# EAGLE design Mergen Telemetri + Ateşleme (EAGLE 9.6.2)
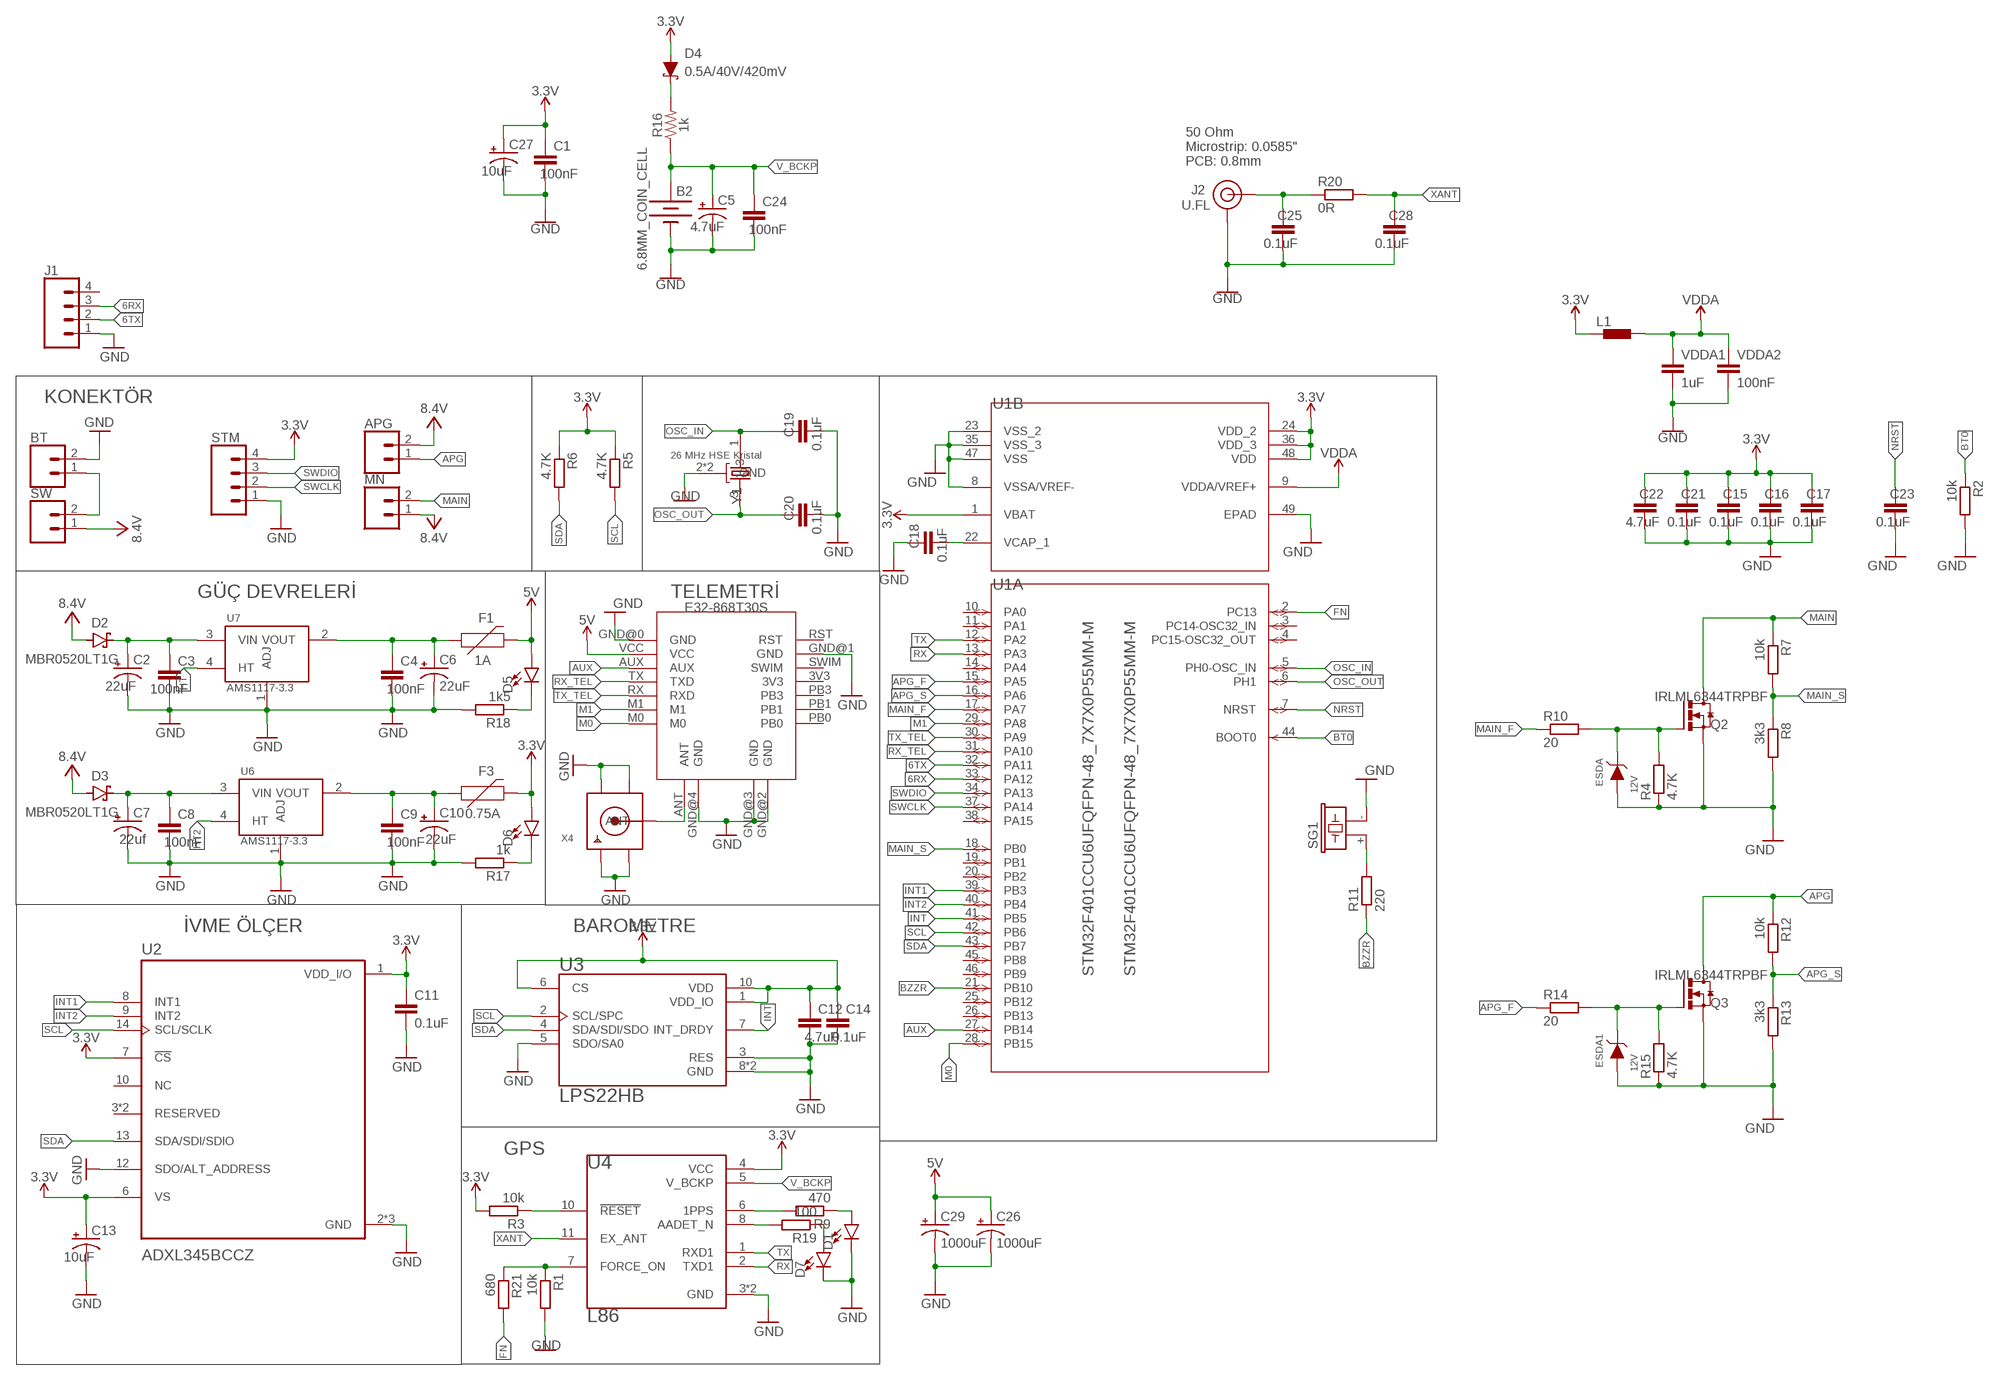
[diagram p0: schematic, sheet 1]

## Parts
APG  CONN_02POLAR  [MOLEX-1X2]
B2  6.8MM_COIN_CELL  BATTERY-6.8MM_SMD  [BATTCON-6.8MM]
BT  CONN_02POLAR  [MOLEX-1X2]
C1  100nF  C-EUC0402K  [C0402K]
C2  22uF  CPOL-USR/2012-12W  [R/2012-12W]
C3  100nF  C-EUC0402K  [C0402K]
C4  100nF  C-EUC0402K  [C0402K]
C5  4.7uF  CPOL-USR/2012-12W  [R/2012-12W]
C6  22uF  CPOL-USR/2012-12W  [R/2012-12W]
C7  22uf  CPOL-USR/2012-12W  [R/2012-12W]
C8  100nF  C-EUC0402K  [C0402K]
C9  100nF  C-EUC0402K  [C0402K]
C10  22uF  CPOL-USR/2012-12W  [R/2012-12W]
C11  0.1uF  C-EUC0402K  [C0402K]
C12  4.7uF  C-EUC0402K  [C0402K]
C13  10uF  CPOL-USR/2012-12W  [R/2012-12W]
C14  0.1uF  C-EUC0402K  [C0402K]
C15  0.1uF  C-EUC0402K  [C0402K]
C16  0.1uF  C-EUC0402K  [C0402K]
C17  0.1uF  C-EUC0402K  [C0402K]
C18  0.1uF  C-EUC0402K  [C0402K]
C19  0.1uF  C-EUC0402K  [C0402K]
C20  0.1uF  C-EUC0402K  [C0402K]
C21  0.1uF  C-EUC0402K  [C0402K]
C22  4.7uF  C-EUC0402K  [C0402K]
C23  0.1uF  C-EUC0402K  [C0402K]
C24  100nF  C-EUC0402K  [C0402K]
C25  0.1uF  C-EUC0402K  [C0402K]
C26  1000uF  CPOL-US150CLZ-1010  [150CLZ-1010]
C27  10uF  CPOL-USR/2012-12W  [R/2012-12W]
C28  0.1uF  C-EUC0402K  [C0402K]
C29  1000uF  CPOL-US150CLZ-1010  [150CLZ-1010]
D1  LED0603  [LED-0603]
D2  MBR0520LT1G  SCHOTTKY_MBR0520LT1GDO-219  [SODFL3718X115]
D3  MBR0520LT1G  SCHOTTKY_MBR0520LT1GDO-219  [SODFL3718X115]
D4  0.5A/40V/420mV  DIODE-SCHOTTKY-PMEG4005EJ  [SOD-323]
D5  LED0603  [LED-0603]
D6  LED0603  [LED-0603]
D7  LED0603  [LED-0603]
ESDA  12V  WE-TVSP_DO-214AC_400W_UNI_824500102  [WE-TVSP_DO-214AC_UNIDIRECTIONAL]
ESDA1  12V  WE-TVSP_DO-214AC_400W_UNI_824500102  [WE-TVSP_DO-214AC_UNIDIRECTIONAL]
F1  1A  PPTC_HALF-AMP  [1206]
F3  0.75A  PPTC_HALF-AMP  [1206]
J1  CONN_04JST-PTH-VERT  [JST-4-PTH-VERT]
J2  U.FL  U.FL2PIN  [U.FL]
L1  BLM15HB221SN1  [0402]
MN  CONN_02POLAR  [MOLEX-1X2]
Q2  IRLML6344TRPBF  [SOT23]
Q3  IRLML6344TRPBF  [SOT23]
R1  10k  R-EU_R0402  [R0402]
R2  10k  R-EU_R0402  [R0402]
R3  10k  R-EU_R0402  [R0402]
R4  4.7K  R-EU_R0402  [R0402]
R5  4.7K  R-EU_R0402  [R0402]
R6  4.7K  R-EU_R0402  [R0402]
R7  10k  R-EU_R0402  [R0402]
R8  3k3  R-EU_R0402  [R0402]
R9  470  R-EU_R0402  [R0402]
R10  20  R-EU_R0402  [R0402]
R11  220  R-EU_R0402  [R0402]
R12  10k  R-EU_R0402  [R0402]
R13  3k3  R-EU_R0402  [R0402]
R14  20  R-EU_R0402  [R0402]
R15  4.7K  R-EU_R0402  [R0402]
R16  1k  1KOHM-0603-1/10W-1%  [0603]
R17  1k  R-EU_R0402  [R0402]
R18  1k5  R-EU_R0402  [R0402]
R19  100  R-EU_R0402  [R0402]
R20  0R  R-EU_R0402  [R0402]
R21  680  R-EU_R0402  [R0402]
SG1  F/CM12P  [F/CM12P]
STM  CONN_04  [1X04]
SW  CONN_02POLAR  [MOLEX-1X2]
U1  STM32F401CCU6UFQFPN-48_7X7X0P55MM-M  [UFQFPN-48_7X7X0P55MM-M]
U2  ADXL345BCCZ  [PQFN80P300X500X100-14N]
U3  LPS22HB  [LGA10R50P2X3_200X200X80]
U4  L86  [XCVR_L86]
U5  E32-868T30S  [E32-868T30S]
U6  AMS1117-3.3  [SOT229P700X180-4N]
U7  AMS1117-3.3  [SOT229P700X180-4N]
VDDA1  1uF  0.1UF-0603-25V-(+80/-20%)  [0603]
VDDA2  100nF  0.1UF-0603-25V-(+80/-20%)  [0603]
X4  SMACONNECTOR  [SMA90_DIP]
Y1  ABM3B-26.000MHZ-10-1-U-T  [OSCCC500X320X110-4N]

## Nets
3.3V: C1.1 C11.1 C12.1 C13.+ C14.1 C15.1 C16.1 C17.1 C21.1 C22.1 C27.+ D4.A D6.A F3.2 L1.1 R3.2 R5.1 R6.1 STM.4 U1.1(B:VBAT) U1.24(B:VDD_2) U1.36(B:VDD_3) U1.48(B:VDD) U2.1(VDD_I/O) U2.6(VS) U2.7(!CS) U3.1(VDD_IO) U3.6(CS) U3.10(VDD) U4.4(VCC)
5V: C26.+ C29.+ D5.A F1.2 U5.VCC
6RX: J1.3 U1.33(A:PA12)
6TX: J1.2 U1.32(A:PA11)
APG: APG.1 Q3.3(D) R12.1
APG_F: R14.1 U1.15(A:PA5)
APG_S: R12.2 R13.1 U1.16(A:PA6)
AUX: U1.27(A:PB14) U5.AUX
BT0: R2.1 U1.44(A:BOOT0)
BZZR: R11.1 U1.21(A:PB10)
FN: R21.2 U1.2(A:PC13)
GND: B2.- BT.2 C1.2 C2.- C3.2 C4.2 C5.- C6.- C7.- C8.2 C9.2 C10.- C11.2 C12.2 C13.- C14.2 C15.2 C16.2 C17.2 C18.1 C19.2 C20.2 C21.2 C22.2 C23.2 C24.2 C25.2 C26.- C27.- C28.2 C29.- D1.C D7.C ESDA1.2(A) ESDA.2(A) J1.1 J2.1(GND) J2.2(GND) Q2.2(S) Q3.2(S) R1.2 R2.2 R4.1 R8.2 R13.2 R15.1 R17.2 R18.2 SG1.- STM.1 U1.8(B:VSSA/VREF-) U1.23(B:VSS_2) U1.35(B:VSS_3) U1.47(B:VSS) U1.49(B:EPAD) U2.2(GND) U2.4(GND) U2.5(GND) U2.12(SDO/ALT_ADDRESS) U3.3(RES) U3.5(SDO/SA0) U3.8(GND) U3.9(GND) U4.3(GND) U4.12(GND) U5.GND@0(GND) U5.GND@1(GND) U5.GND@2(GND) U5.GND@3(GND) U5.GND@4(GND) U6.1(ADJ) U7.1(ADJ) VDDA1.2 VDDA2.2 X4.GND1 X4.GND2 X4.GND3 X4.GND4 Y1.2(GND) Y1.4(GND)
HT: U7.4(HT)
HT2: U6.4(HT)
INT: U1.41(A:PB5) U3.7(INT_DRDY)
INT1: U1.39(A:PB3) U2.8(INT1)
INT2: U1.40(A:PB4) U2.9(INT2)
M0: U1.28(A:PB15) U5.M0
M1: U1.29(A:PA8) U5.M1
MAIN: MN.2 Q2.3(D) R7.1
MAIN_F: R10.1 U1.17(A:PA7)
MAIN_S: R7.2 R8.1 U1.18(A:PB0)
N$1: C2.+ C3.1 D2.1(C) U7.3(VIN)
N$2: C7.+ C8.1 D3.1(C) U6.3(VIN)
N$3: R3.1 U4.10(!RESET)
N$4: C4.1 C6.+ F1.1 U7.2(VOUT)
N$5: C9.1 C10.+ F3.1 U6.2(VOUT)
N$6: ESDA1.1(C) Q3.1(G) R14.2 R15.2
N$7: U5.ANT X4.ANTENNA(ANT)
N$8: R11.2 SG1.+
N$9: BT.1 SW.2
N$10: R9.2 U4.6(1PPS)
N$11: D1.A R9.1
N$12: D4.C R16.2
N$13: ESDA.1(C) Q2.1(G) R4.2 R10.2
N$14: D5.C R18.1
N$15: D6.C R17.1
N$16: R19.2 U4.8(AADET_N)
N$17: D7.A R19.1
N$18: C18.2 U1.22(B:VCAP_1)
N$19: C25.1 J2.FEED(SIGNAL) R20.1
N$20: R1.1 R21.1 U4.7(FORCE_ON)
NRST: C23.1 U1.7(A:NRST)
OSC_IN: C19.1 U1.5(A:PH0-OSC_IN) Y1.1
OSC_OUT: C20.1 U1.6(A:PH1) Y1.3
RX: U1.13(A:PA3) U4.2(TXD1)
RX_TEL: U1.31(A:PA10) U5.TX(TXD)
SCL: R5.2 U1.42(A:PB6) U2.14(SCL/SCLK) U3.2(SCL/SPC)
SDA: R6.2 U1.43(A:PB7) U2.13(SDA/SDI/SDIO) U3.4(SDA/SDI/SDO)
SWCLK: STM.2 U1.37(A:PA14)
SWDIO: STM.3 U1.34(A:PA13)
TX: U1.12(A:PA2) U4.1(RXD1)
TX_TEL: U1.30(A:PA9) U5.RX(RXD)
V_BCKP: B2.+ C5.+ C24.1 R16.1 U4.5(V_BCKP)
VCC: APG.2 D2.2(A) D3.2(A) MN.1 SW.1 ; supply symbol labelled 8.4V
VDDA: L1.2 U1.9(B:VDDA/VREF+) VDDA1.1 VDDA2.1
XANT: C28.1 R20.2 U4.11(EX_ANT)
Unconnected: J1.4 U1.3(A:PC14-OSC32_IN) U1.4(A:PC15-OSC32_OUT) U1.10(A:PA0) U1.11(A:PA1) U1.14(A:PA4) U1.19(A:PB1) U1.20(A:PB2) U1.25(A:PB12) U1.26(A:PB13) U1.38(A:PA15) U1.45(A:PB8) U1.46(A:PB9) U2.3(RESERVED) U2.10(NC) U2.11(RESERVED) U5.3V3 U5.PB0 U5.PB1 U5.PB3 U5.RST U5.SWIM

## Notes on the sheet
- 50 Ohm 
  Microstrip: 0.0585"
  PCB: 0.8mm
- KONEKTÖR
- 26 MHz HSE Kristal
- GÜÇ DEVRELERİ | TELEMETRİ
- İVME ÖLÇER | BAROMETRE
- GPS

## Library data of the parts
APG BT MN SW = SparkFun-Connectors:CONN_02: Multi connection point. Often used as Generic Header-pin footprint for 0.1 inch spaced/style header connections On any of the 0.1 inch spaced packages, you can populate with these: Break Away Headers - Straight <https://www.sparkfun.com/products/116> (PRT-00116) Break Away Male Headers - Right Angle <https://www.sparkfun.com/products/553> (PRT-00553) Female Headers <https://www.sparkfun.com/products/115> (PRT-00115) Break Away Headers - Machine Pin <https://www.sparkfun.com/products/117> (PRT-00117) Break Away Female Headers - Swiss Machine Pin <https://www.sparkfun.com/products/743> (PRT-00743) For SCREWTERMINALS and SPRING TERMINALS visit here: Screw Terimnals on SparkFun.com <https://www.sparkfun.com/search/results?term=Screw+Terminals> (5mm/3.5mm/2.54mm spacing) This device is also useful as a general connection point to wire up your design to another part of your project. Our various solder wires solder well into these plated through hole pads. Hook-Up Wire - Assortment (Stranded, 22 AWG) <https://www.sparkfun.com/products/11375> (PRT-11375) Hook-Up Wire - Assortment (Solid Core, 22 AWG) <https://www.sparkfun.com/products/11367> (PRT-11367) View the entire wire category on our website here <https://www.sparkfun.com/categories/141> Special notes: Molex polarized connector foot print use with: PRT-08233 with associated crimp pins and housings. 2.54_SCREWTERM for use with PRT-10571. 3.5mm Screw Terminal footprints for PRT-08084 5mm Screw Terminal footprints for use with PRT-08432; SF_ID: PRT-09918
B2 = SparkFun-Batteries:BATTERY: Battery - Single Cell A variety of battery chemistries, sizes, and footprints. Device List: 20MM_PTH - Coin Cell Battery Holder - 20mm (PTH) <https://www.sparkfun.com/products/783> 6.8MM_PTH - Coin Cell Battery Holder - 6.8MM(SMD) <https://www.digikey.com/product-detail/en/seiko-instruments/MS621FE-FL11E/728-1057-ND/1889208?WT.srch=1&gclid=CNOQ5a6LzdQCFZS2wAodXCkE0g> 12MM_SMD - Coin Cell Battery Holder - 12mm (SMD) <https://www.sparkfun.com/products/10592> 12MM_PTH - Coin Cell Battery Holder - 12mm (PTH) <https://www.sparkfun.com/products/7948> 20MM_SMD - 20mm Coin Cell Battery Holder (SMD) (2 legs) Used on the Big Time Watch Kit <https://www.sparkfun.com/products/11734> 20MM_SMD_4LEGS - Coin Cell Battery Holder - 20mm (SMD) <https://www.sparkfun.com/products/11892> 20MM_SMD_4LEGS_OVERPASTE - Coin Cell Battery Holder - 20mm (SMD) <https://www.sparkfun.com/products/11892> (Over-paste on the legs) 24.5MM_PTH - Coin Cell Battery Holder - 24.5mm (PTH) <https://www.sparkfun.com/products/8863> 9V - 9V Battery Holder - PC Mount Used on the SparkFun SparkPunk Sound Kit <https://www.sparkfun.com/products/11177> and SparkFun SparkPunk Sequencer Kit <https://www.sparkfun.com/products/12707> 18650 - Battery Holder - 18650 (PTH) <https://www.sparkfun.com/products/13113> AA - Battery Holder - 1xAA (PTH) <https://www.sparkfun.com/products/7949> AAA - Battery Holder - 1xAAA (PTH) <https://www.sparkfun.com/products/12718> AA_KIT - Battery Holder - 1xAA (PTH) <https://www.sparkfun.com/products/7949> Special kit package - pads only have exposed copper on one side of the board. AAA_KIT - Battery Holder - 1xAAA (PTH) <https://www.sparkfun.com/products/12718> Special kit package - pads only have exposed copper on one side of the board.; PROD_ID: BATT-13734
C1 C3 C4 C8 C9 C11 C12 C14-C25 C28 = rcl:C-EU: CAPACITOR, European symbol; SPICEPREFIX: C
C2 C5-C7 C10 C13 C27 = rcl:CPOL-US: POLARIZED CAPACITOR, American symbol; SPICEPREFIX: C
C26 C29 = adafruit:CPOL-US: POLARIZED CAPACITOR, American symbol
D1 D5-D7 = SparkFun-LED:LED: LED (Generic) Standard schematic elements and footprints for 5mm, 3mm, 1206, and 0603 sized LEDs. Generic LEDs with no color specified.
D2 D3 = Diode:SCHOTTKY_: Schottky Diode - Popular parts; CATEGORY: Diode; DESCRIPTION: DIODE SCHOTTKY 20V 500MA SOD123; MANUFACTURER: ON Semiconductor; MPN: MBR0520LT1G; SUB-CATEGORY: Schottky
D4 = SparkFun-DiscreteSemi:DIODE-SCHOTTKY: Schottky diode A Schottky diode is a semiconductor diode which has a low forward voltage drop and a very fast switching action.; PROD_ID: DIO-10955
ESDA ESDA1 = Wurth_EMC Components_WE-TVSP:WE-TVSP_DO-214AC_400W_UNI: WE-TVSP Power TVS Diode Characteristics Low Profile Package Glass passivated Juction Excellent clamping capability Fast response time MSL Level 1, per J-STD-020 Classification of the plastic case: UL 94 V-0 Safety certification UL 497B, E478010 Identical design: - DO-214AC = SMAJ - DO-214AA = SMBJ - DO-214AB = SMCJ/SMDJ Applications Ideal to protect the I/O Interfaces, Bus Voltage and other circuits of sensetive electronic equipment against voltage transiensts <https://www.we-online.com/catalog/media/o55793v209%20WE-TVSP_600W-3000W_D0214AA_4C.jpg> Details see: https://www.we-online.com/catalog/en/WE-TVSP/ Updated by Ella Wu 2020-07-20 2020 (C) Würth Elektronik; DATASHEET-URL: https://www.we-online.com/catalog/datasheet/824500102.pdf; IPEAK: 2.5A; MOUNT: SMT; PART-NUMBER: 824500102; PDISS: 400W; VALUE: 100V; VBR: 117V; VCLAMP: 162V
F1 F3 = SparkFun-Fuses:PPTC: Resettable Fuse PPTC Resettable Fuse. Really a sort of resistor with a polymeric positive temperature coefficient whose resistance increases dramatically with an increase in temperature. When heated by the power passing through the resistance rises causing the current to be limited, protecting the circuit. This is achieved by the transition of the polymer from a crystalline to an amorphous state where the conductive carbon separates breaking the conductive pathways found in the cool crystalline structure. When a PPTC cools back down it resumes conducting letting the circuit turn back on. SparkFun Products: SparkFun RedBoard - Programmed with Arduino <https://www.sparkfun.com/products/12757> Pro Micro - 5V/16MHz <https://www.sparkfun.com/products/12640> Arduino Pro 328 - 5V/16MHz <https://www.sparkfun.com/products/10915> MP3 Trigger <https://www.sparkfun.com/products/13720>; PROD_ID: RES-08585; VALUE: 6V/0.5A
J1 = SparkFun-Connectors:CONN_04: Multi connection point. Often used as Generic Header-pin footprint for 0.1 inch spaced/style header connections On any of the 0.1 inch spaced packages, you can populate with these: Break Away Headers - Straight <https://www.sparkfun.com/products/116> (PRT-00116) Break Away Male Headers - Right Angle <https://www.sparkfun.com/products/553> (PRT-00553) Female Headers <https://www.sparkfun.com/products/115> (PRT-00115) Break Away Headers - Machine Pin <https://www.sparkfun.com/products/117> (PRT-00117) Break Away Female Headers - Swiss Machine Pin <https://www.sparkfun.com/products/743> (PRT-00743) For SCREWTERMINALS and SPRING TERMINALS visit here: Screw Terimnals on SparkFun.com <https://www.sparkfun.com/search/results?term=Screw+Terminals> (5mm/3.5mm/2.54mm spacing) This device is also useful as a general connection point to wire up your design to another part of your project. Our various solder wires solder well into these plated through hole pads. Hook-Up Wire - Assortment (Stranded, 22 AWG) <https://www.sparkfun.com/products/11375> (PRT-11375) Hook-Up Wire - Assortment (Solid Core, 22 AWG) <https://www.sparkfun.com/products/11367> (PRT-11367) View the entire wire category on our website here <https://www.sparkfun.com/categories/141> Special notes: Molex polarized connector foot print use with SKU : PRT-08231 with associated crimp pins and housings. 1MM SMD Version SKU: PRT-10208; PROD_ID: CONN-13251
J2 = SparkFun-Connectors:U.FL2PIN: SMD Antenna Connector - U.FL 2mm height, 3.0mm x 3.0mm receptacle size. SparkFun Products: SparkFun WiFi Shield - ESP8266 <https://www.sparkfun.com/products/13287> SparkFun ESP8266 Thing <https://www.sparkfun.com/products/13231> SparkFun MiniGen - Pro Mini Signal Generator Shield <https://www.sparkfun.com/products/11420>; PROD_ID: CONN-09193; SF_ID: WRL-09144
L1 = inductors:BLM15H: EMIFIL (R) Chip Ferrite Bead for GHz Noise Source: http://www.murata.com/ Ferrite Bead BLM15H.pdf
Q2 Q3 = IRLML6344TRPBF (1):IRLML6344TRPBF: Transistor NMOS 30V 6.3A, 29mOhm@4.5V; AVAILABILITY: Unavailable; DESCRIPTION: RoHS Compliant | Low RDS(on) | Industry-Standard Pinout | Compatible with Existing Surface Mount Techniques | Qualified MSL1 | SOT-23 Footprint; MF: Infineon; MP: IRLML6344TRPBF; PACKAGE: SOT-23-3 International Rectifier; PRICE: None
R1-R15 R17-R21 = rcl:R-EU_: RESISTOR, European symbol; SPICEPREFIX: R
R16 = SparkFun-Resistors:1KOHM: 1kΩ resistor A resistor is a passive two-terminal electrical component that implements electrical resistance as a circuit element. Resistors act to reduce current flow, and, at the same time, act to lower voltage levels within circuits. - Wikipedia; PROD_ID: RES-07856
SG1 = buzzer:F/CM12P: BUZZER Source: Buerklin; OC_FARNELL: unknown; OC_NEWARK: unknown
STM = SparkFun-Connectors:CONN_04: Multi connection point. Often used as Generic Header-pin footprint for 0.1 inch spaced/style header connections On any of the 0.1 inch spaced packages, you can populate with these: Break Away Headers - Straight <https://www.sparkfun.com/products/116> (PRT-00116) Break Away Male Headers - Right Angle <https://www.sparkfun.com/products/553> (PRT-00553) Female Headers <https://www.sparkfun.com/products/115> (PRT-00115) Break Away Headers - Machine Pin <https://www.sparkfun.com/products/117> (PRT-00117) Break Away Female Headers - Swiss Machine Pin <https://www.sparkfun.com/products/743> (PRT-00743) For SCREWTERMINALS and SPRING TERMINALS visit here: Screw Terimnals on SparkFun.com <https://www.sparkfun.com/search/results?term=Screw+Terminals> (5mm/3.5mm/2.54mm spacing) This device is also useful as a general connection point to wire up your design to another part of your project. Our various solder wires solder well into these plated through hole pads. Hook-Up Wire - Assortment (Stranded, 22 AWG) <https://www.sparkfun.com/products/11375> (PRT-11375) Hook-Up Wire - Assortment (Solid Core, 22 AWG) <https://www.sparkfun.com/products/11367> (PRT-11367) View the entire wire category on our website here <https://www.sparkfun.com/categories/141> Special notes: Molex polarized connector foot print use with SKU : PRT-08231 with associated crimp pins and housings. 1MM SMD Version SKU: PRT-10208; PROD_ID: CONN-09696
U1 = STM32F401CCU6:STM32F401CCU6; BUILT_BY: EMA_UL_Team; COPYRIGHT: Copyright (C) 2018 Accelerated Designs. All rights reserved; MANUFACTURER_PART_NUMBER: STM32F401CCU6; SOURCELIBRARY: Updates_to_database_2020-10-19; VENDOR: STMicroelectronics
U2 = ADXL345BCCZ:ADXL345BCCZ: Check prices <https://pricing.snapeda.com/parts/ADXL345BCCZ/Analog%20Devices/view-part?ref=eda>; AVAILABILITY: Warning; DESCRIPTION: Accelerometer X, Y, Z Axis ±2g, 4g, 8g, 16g 0.05Hz ~ 1.6kHz 14-LGA (3x5); MF: Analog Devices; MP: ADXL345BCCZ; PACKAGE: LGA -14 Analog Devices; PRICE: None; PURCHASE-URL: https://pricing.snapeda.com/search/part/ADXL345BCCZ/?ref=eda
U3 = LPS22HB:LPS22HB: MEMS nano pressure sensor: 260-1260 hPa absolute digital output barometer; AVAILABILITY: Unavailable; DESCRIPTION: Pressure Sensor 3.77PSI ~ 18.27PSI (26kPa ~ 126kPa) Absolute 24 b 10-WFLGA Exposed Pad; MF: STMicroelectronics; MP: LPS22HB; PACKAGE: WFLGA-10 STMicroelectronics; PRICE: None
U4 = L86:L86: L86 is an ultra-compact GNSS POT (Patch on Top) module with an embedded 18.4mm × 18.4mm × 4.0mm patch antenna and utilizes the MediaTek new generation GNSS chipset MT3333 that achieves the perfect performance; AVAILABILITY: Unavailable; DESCRIPTION: L86 is an ultra-compact GNSS POT (Patch on Top) module with an embedded 18.4mm × 18.4mm × 4.0mm patch antenna and utilizes the MediaTek new generation GNSS chipset MT3333 that achieves the perfect performance; MF: Quectel; MP: L86; PACKAGE: PowerSFN-8 Quectel; PRICE: None
U5 = E32-868T30S:E32-868T30S: E BYTE E32-868T30S
U6 U7 = AMS1117-3.3:AMS1117-3.3: Sot223/Pkg 1-Amp 3.3-Volt Low Drop Out Voltage Regulatator; AVAILABILITY: Unavailable; DESCRIPTION: Sot223/Pkg 1-Amp 3.3-Volt Low Drop Out Voltage Regulatator; MF: Advanced Monolithic Systems; MP: AMS1117-3.3; PACKAGE: SOT-89 ams; PRICE: None
VDDA1 VDDA2 = SparkFun-Capacitors:0.1UF: 0.1µF ceramic capacitors A capacitor is a passive two-terminal electrical component used to store electrical energy temporarily in an electric field.; PROD_ID: CAP-00810; VALUE: 0.1uF
X4 = adafruit:SMACONNECTOR: SMA Connector 90° DIP SMA Connector, 50 Ohm (4UConnector: 07259)
Y1 = ABM3B-26.000MHZ-10-1-U-T:ABM3B-26.000MHZ-10-1-U-T: Ceramic SMD Crystal Check prices <https://pricing.snapeda.com/parts/ABM3B-26.000MHZ-10-1-U-T/Abracon/view-part?ref=eda>; AVAILABILITY: Good; DESCRIPTION: 26MHz ±10ppm Crystal 10pF 50 Ohms 4-SMD, No Lead; MF: Abracon; MP: ABM3B-26.000MHZ-10-1-U-T; PACKAGE: SMD-4 Abracon LLC; PRICE: None; PURCHASE-URL: https://pricing.snapeda.com/search/part/ABM3B-26.000MHZ-10-1-U-T/?ref=eda

## Board
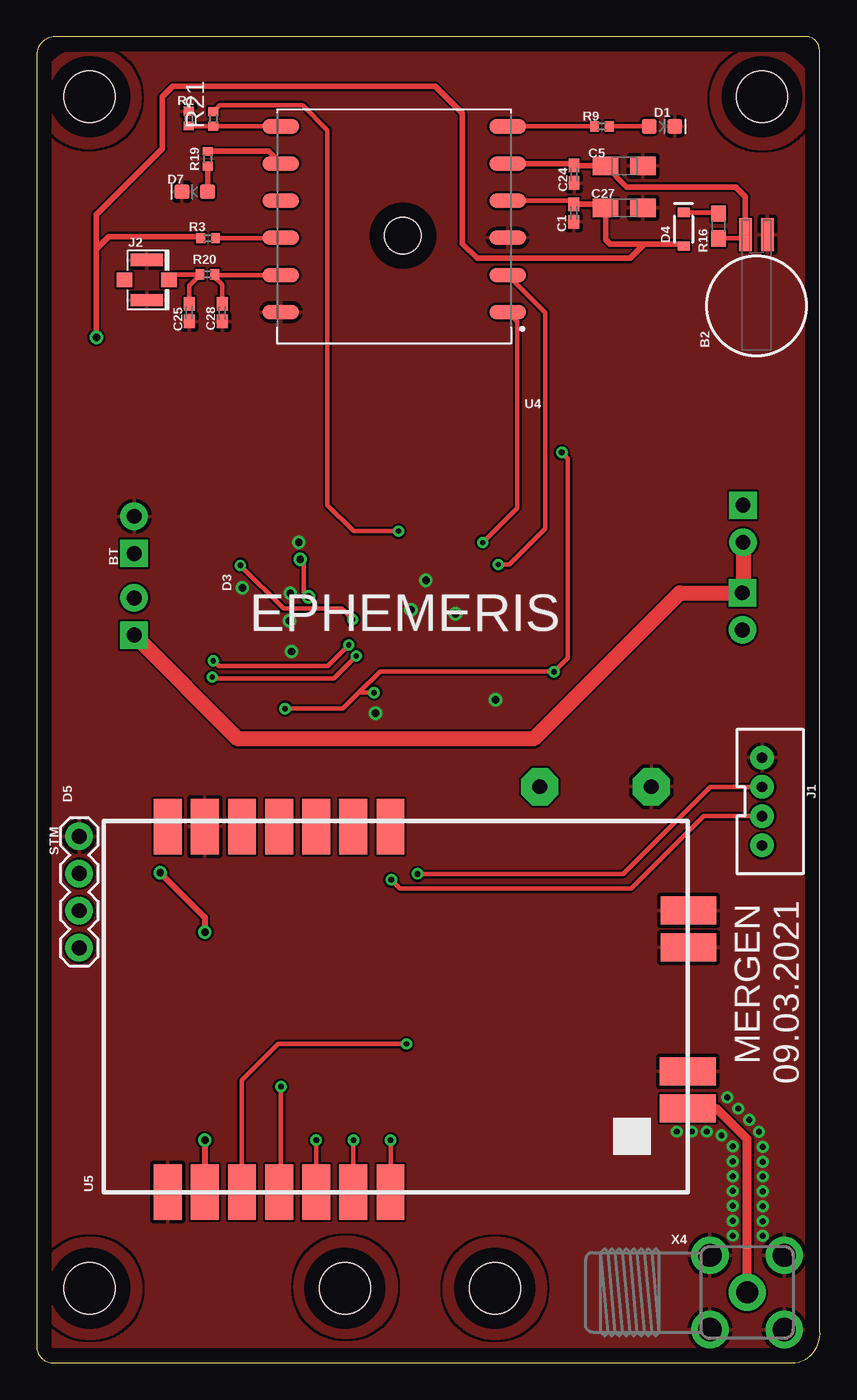
[diagram p1: board, top side]
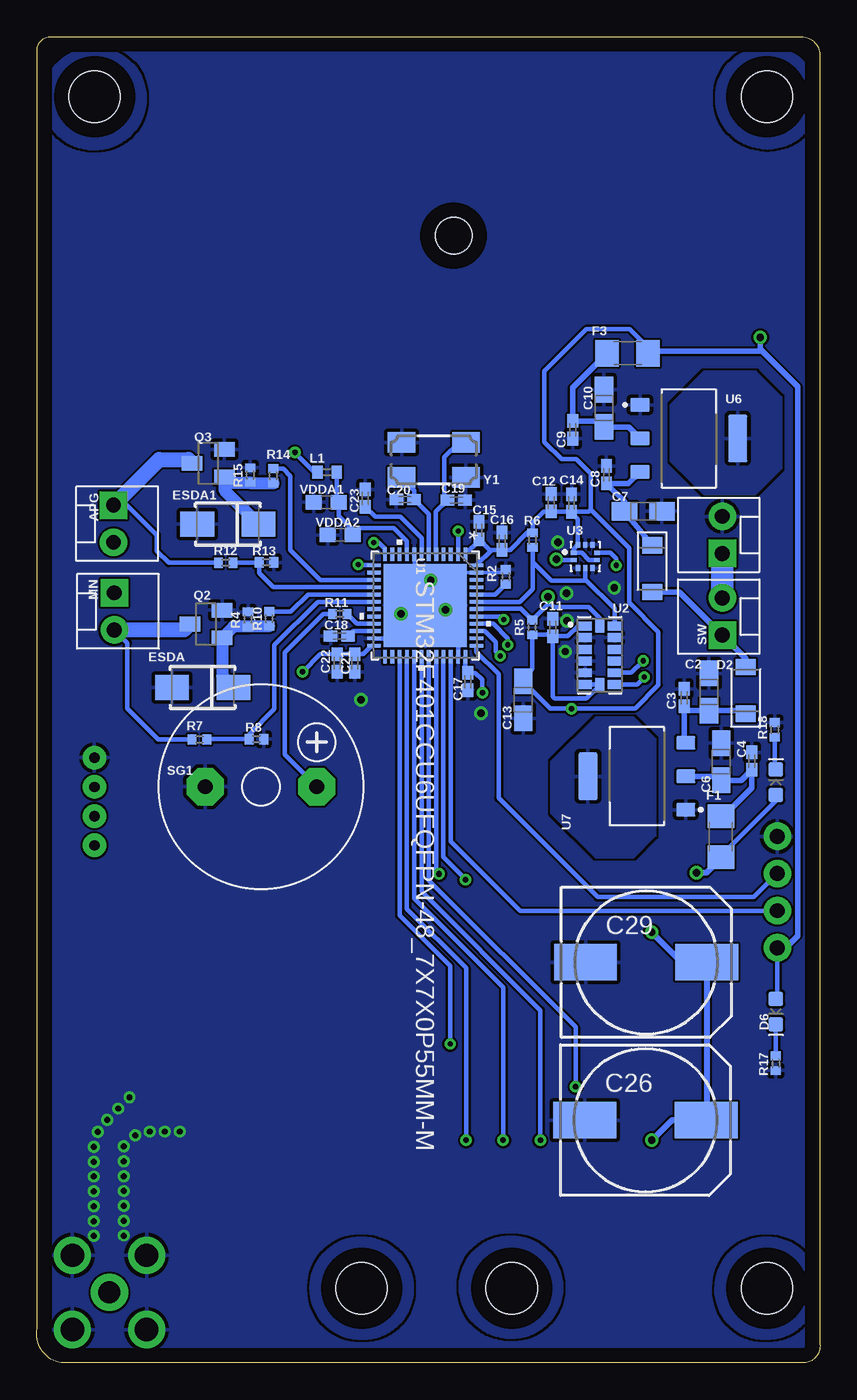
[diagram p2: board, bottom side, seen from below]

Size 53.57 x 90.73 mm. Coordinates in mm from the lower left corner, seen from the top.
Outline: 0,89.49 0,1.27 arc90 1.09,0 51.89,0 arc90 53.54,2.36 53.54,89.79 arc90 52.6,90.73 1.39,90.73 arc90 0,89.49
Copper layers (1*16): Top 0.035mm / dielectric 1.5mm / Bottom 0.035mm
Design rules "default": minimum track width 6mil, minimum drill 0.35mm, track to track 6mil, track to pad 6mil, pad to pad 6mil, via to via 6mil, smd to smd 6mil, copper to edge 40mil, drill to drill 6mil, minimum pad ring 10mil, minimum via ring 8mil, stop-mask expansion 4mil, vias tented up to drill 0mil, thermal gap 10mil
Holes 3.5 mm at 3.63,86.61 49.6,86.61 31.34,5.1 3.63,5.1 21.08,5.1
Holes 2.5 mm at 25.05,77.1

### Footprints (pad centres in the part's own frame; a part is rotated, then mirrored left to right if it is on the bottom)
MOLEX-1X2 = drill 1.016 pad 1.88 square: 1 0,0 | drill 1.016 pad 1.88: 2 2.54,0
BATTCON-6.8MM = smd 2.25 x 0.85: + 4.87,0.75; - 4.87,-0.75
C0402K = smd 0.925 x 0.74: 1 -0.6,0; 2 0.6,0
R/2012-12W = smd 1.75 x 1.26: + 1.275,0; - -1.275,0
150CLZ-1010 = smd 4.3 x 2.5: + 4.15,0; - -4.15,0
LED-0603 = smd 1 x 1: A -0.877,0; C 0.877,0
SODFL3718X115 = smd 1.115 x 1.361: 1 -1.6,0; 2 1.6,0
SOD-323 = smd 0.63 x 0.83: A 1.15,0; C -1.15,0
WE-TVSP_DO-214AC_UNIDIRECTIONAL = smd 2.3 x 1.7: 1 -2.1,0; 2 2.1,0
1206 = smd 1.6 x 1.8: 1 -1.4,0; 2 1.4,0
JST-4-PTH-VERT = drill 0.7 pad 1.6: 1 -3,-0.55; 2 -1,-0.55; 3 1,-0.55; 4 3,-0.55
U.FL = smd 2.2 x 0.85: 1 0,1.375; 2 0,-1.375 | smd 1.05 x 1: FEED 1.525,0; NC -1.525,0
0402 = smd 0.7 x 0.9: 1 -0.65,0; 2 0.65,0
SOT23 = smd 1 x 1.4: 1 -0.95,-1.1; 2 0.95,-1.1; 3 0,1.1
R0402 = smd 0.6 x 0.7: 1 -0.5,0; 2 0.5,0
0603 = smd 1.1 x 1: 1 -0.85,0; 2 0.85,0
F/CM12P = drill 1.016 pad 2.54 octagon: + 3.81,0; - -3.81,0
1X04 = drill 1.016 pad 1.88: 1 0,0; 2 2.54,0; 3 5.08,0; 4 7.62,0
UFQFPN-48_7X7X0P55MM-M = smd 0.908 x 0.255: 1 -3.502,2.75; 2 -3.502,2.25; 3 -3.502,1.75; 4 -3.502,1.25; 5 -3.502,0.75; 6 -3.502,0.25; 7 -3.502,-0.25; 8 -3.502,-0.75; 9 -3.502,-1.25; 10 -3.502,-1.75; 11 -3.502,-2.25; 12 -3.502,-2.75; 25 3.502,-2.75; 26 3.502,-2.25; 27 3.502,-1.75; 28 3.502,-1.25; 29 3.502,-0.75; 30 3.502,-0.25; 31 3.502,0.25; 32 3.502,0.75; 33 3.502,1.25; 34 3.502,1.75; 35 3.502,2.25; 36 3.502,2.75 | smd 0.255 x 0.908: 13 -2.75,-3.502; 14 -2.25,-3.502; 15 -1.75,-3.502; 16 -1.25,-3.502; 17 -0.75,-3.502; 18 -0.25,-3.502; 19 0.25,-3.502; 20 0.75,-3.502; 21 1.25,-3.502; 22 1.75,-3.502; 23 2.25,-3.502; 24 2.75,-3.502; 37 2.75,3.502; 38 2.25,3.502; 39 1.75,3.502; 40 1.25,3.502; 41 0.75,3.502; 42 0.25,3.502; 43 -0.25,3.502; 44 -0.75,3.502; 45 -1.25,3.502; 46 -1.75,3.502; 47 -2.25,3.502; 48 -2.75,3.502 | smd 5.69 x 5.69: 49 0,0
PQFN80P300X500X100-14N = smd 0.92 x 0.61: 1 -1.01,2; 2 -1.01,1.2; 3 -1.01,0.4; 4 -1.01,-0.4; 5 -1.01,-1.2; 6 -1.01,-2; 8 1.01,-2; 9 1.01,-1.2; 10 1.01,-0.4; 11 1.01,0.4; 12 1.01,1.2; 13 1.01,2 | smd 0.61 x 0.92: 7 0,-2.01; 14 0,2.01
LGA10R50P2X3_200X200X80 = smd 0.4 x 0.3: 1 -0.8,0.25; 2 -0.8,-0.25; 6 0.8,-0.25; 7 0.8,0.25 | smd 0.3 x 0.4: 3 -0.5,-0.8; 4 0,-0.8; 5 0.5,-0.8; 8 0.5,0.8; 9 0,0.8; 10 -0.5,0.8
XCVR_L86 = smd 2.5 x 1: 1 -7.75,6.35; 2 -7.75,3.81; 3 -7.75,1.27; 4 -7.75,-1.27; 5 -7.75,-3.81; 6 -7.75,-6.35; 7 7.75,-6.35; 8 7.75,-3.81; 9 7.75,-1.27; 10 7.75,1.27; 11 7.75,3.81; 12 7.75,6.35
E32-868T30S = smd 3.81 x 1.905: 3V3 12.3,5.08; AUX -12.7,7.62; GND@0 -12.7,12.7; GND@1 12.3,10.16; M0 -12.7,-2.54; M1 -12.7,0; PB0 12.3,-2.54; PB1 12.3,0; PB3 12.3,2.54; RST 12.3,12.7; RX -12.7,2.54; SWIM 12.3,7.62; TX -12.7,5.08; VCC -12.7,10.16 | smd 1.905 x 3.81: ANT -6.97,-22.86; GND@2 6.57,-22.91; GND@3 4.03,-22.91; GND@4 -4.43,-22.86
SOT229P700X180-4N = smd 0.93 x 1.31: 1 -2.29,-3.345; 2 0,-3.345; 3 2.29,-3.345 | smd 3.24 x 1.31: 4 0,3.345
SMA90_DIP = drill 1.5 pad 2.54: ANTENNA 0,0 | drill 1.6 pad 2.54: GND1 -2.54,2.54; GND2 2.54,2.54; GND3 -2.54,-2.54; GND4 2.54,-2.54
OSCCC500X320X110-4N = smd 1.9 x 1.4: 1 -2.2,-1.2; 2 2.2,-1.2; 3 2.2,1.2; 4 -2.2,1.2

### Placement (x,y rotation side)
APG  48.31,58.67 270 bottom
B2  49.22,72.31 90 top
BT  6.68,55.37 90 bottom
C1  36.73,78.66 270 top
C2  7.59,45.9 270 bottom
C3  9.29,45.52 90 bottom
C4  4.67,41.17 90 bottom
C5  40.18,81.89 180 top
C6  6.75,41.12 270 bottom
C7  12.09,58.27 180 bottom
C8  14.6,60.76 90 bottom
C9  16.91,63.83 270 bottom
C10  14.78,65.3 270 bottom
C11  18.29,50.32 90 bottom
C12  18.39,58.85 90 bottom
C13  20.29,45.36 90 bottom
C14  16.99,58.83 90 bottom
C15  23.31,56.95 90 bottom
C16  21.74,56.21 90 bottom
C17  24.08,46.61 270 bottom
C18  32.86,49.73 0 bottom
C19  24.86,59.03 0 bottom
C20  28.37,59.05 180 bottom
C21  31.82,47.88 270 bottom
C22  33.02,47.88 270 bottom
C23  31.09,59.16 90 bottom
C24  36.75,81.31 270 top
C25  10.43,71.84 270 top
C26  11.94,16.61 0 bottom
C27  40.18,79.02 180 top
C28  12.7,71.84 270 top
C29  11.88,27.41 0 bottom
D1  42.77,84.58 0 top
D2  5.08,46 90 bottom
D3  11.48,54.33 270 bottom
D4  44.24,77.55 270 top
D5  3.02,39.73 90 bottom
D6  3.02,24.03 270 bottom
D7  10.82,80.11 180 top
ESDA  42.21,46.2 180 bottom
ESDA1  40.48,57.38 180 bottom
F1  6.78,35.99 270 bottom
F3  13.15,69.06 0 bottom
J1  50.16,38.4 270 top
J2  7.53,74.07 0 top
L1  33.7,60.93 0 bottom
MN  48.26,52.68 270 bottom
Q2  41.98,50.55 90 bottom
Q3  41.83,61.54 90 bottom
R1  10.41,85.12 90 top
R2  21.49,53.77 90 bottom
R3  11.73,76.94 180 top
R4  39.11,50.88 270 bottom
R5  19.68,50.32 90 bottom
R6  19.66,56.29 270 bottom
R7  42.44,42.65 0 bottom
R8  38.53,42.67 0 bottom
R9  38.66,84.58 180 top
R10  37.67,50.9 270 bottom
R11  32.84,51.23 180 bottom
R12  40.64,54.74 0 bottom
R13  37.84,54.76 0 bottom
R14  37.39,60.68 270 bottom
R15  38.96,60.73 270 bottom
R16  46.63,77.77 90 top
R17  3.02,20.5 270 bottom
R18  3.1,43.31 90 bottom
R19  11.71,82.37 90 top
R20  11.68,74.45 0 top
R21  12.09,85.09 90 top
SG1  38.22,39.42 0 bottom
STM  2.92,36.02 270 top
SW  6.68,49.78 90 bottom
U1  27,51.82 270 bottom
U2  15.06,48.41 0 bottom
U3  16.05,55.17 0 bottom
U4  24.46,78.23 180 top
U5  21.66,24.38 90 top
U6  8.96,63.25 270 bottom
U7  12.52,40.13 90 bottom
VDDA1  33.75,58.88 180 bottom
VDDA2  32.81,56.64 180 bottom
X4  48.59,4.83 90 top
Y1  26.41,61.77 180 bottom

### Tracks (layer width: path | path; a pad name or v marks a point on that pad's centre or on a via)
3.3V  (via drill 0.38, 0.51)
  Top 0.305: v16.99,44.75 20.95,44.75 22.04,45.85 | 22.04,45.85 23.49,47.29 35.35,47.29 v35.38,47.27 36.32,48.21 36.32,61.87 v35.91,62.28 | v23.09,45.85 22.04,45.85 | U4.4 36.49,79.5 C1.1
  Top 0.381: 4.09,75.62 4.08,75.62 4.08,78.56 8.6,83.07 8.6,86.6 9.32,87.32 27.25,87.32 29.11,85.47 29.11,76.58 30.12,75.56 40.59,75.56 41.55,76.53 | v4.09,70.15 4.09,75.62 | 4.09,75.62 4.09,76.18 4.94,77.04 11.13,77.04 R3.2 | 41.55,76.53 44.11,76.53 D4.A | 41.55,76.53 39.22,76.53 38.91,76.84 C27.+ 38.66,79.26 C1.1
  Bottom 0.152: U3.1
  Bottom 0.229: 23.31,56.25 C15.1 | 24.25,47.38 C17.1
  Bottom 0.305: U3.1 16.85,55.67 U3.10 16.55,57.71 16.99,58.15 C14.1 | U3.6 15.8,54.92 16.3,55.42 U3.1 | F3.2 11.75,69.47 13,70.71 15.97,70.71 18.85,67.83 18.85,63 17.68,61.82 16.66,61.82 15.67,60.83 15.67,58.37 | U1.1 23.31,56.25 | U1.36 24.25,47.38 | C22.1 C21.1 | C21.1 34.17,48.48 v35.38,47.27 | C17.1 23.56,47.21 23.09,46.74 v23.09,45.85 | v35.91,62.28 34.57,60.93 L1.1 | STM.4 2.92,25.01 D6.A | C14.1 18.36,58.23 C12.1 18.88,58.25 19.66,57.48 R6.1 20.01,56.79 21.19,55.61 C16.1 | C13.+ 20.29,46.61 | 20.29,46.61 20.42,46.74 19.68,47.47 R5.1 18.39,49.82 C11.1 | 20.29,46.61 18.44,44.75 v16.99,44.75 16.96,44.78 12.65,44.78 11.05,46.38 11.05,50.01 13.05,52.02 13.05,55.75 15.67,58.37 | U1.24 30.66,49.07 31.25,48.48 C21.1 | C16.1 22.58,55.61 C15.1 | U2.6 U2.7 15.06,46.35 15.97,45.44 18.13,45.44 18.29,45.59 C11.1 | C16.1 22.45,55.61 U1.48 | C11.1 17.23,49.72 16.54,50.41 U2.1 | 15.67,58.37 15.81,58.23 C14.1
  Bottom 0.381: 3.95,69.21 1.53,66.8 1.53,29.21 2.35,28.4 STM.4 | F3.2 11.6,69.21 3.95,69.21 | 3.95,69.21 4.09,69.35 v4.09,70.15
5V  (via drill 0.51)
  Top 0.406: v11.5,15.24 U5.VCC | v8.46,33.53 11.5,30.48 v11.5,29.46
  Bottom 0.305: D5.A 3.02,38.43 6.78,34.67 F1.2
  Bottom 0.406: F1.2 6.78,34.52 7.77,33.53 v8.46,33.53 | v11.5,15.24 10.13,16.61 C26.+ 7.73,16.66 C29.+ 9.45,27.41 v11.5,29.46
6RX  (via drill 0.38)
  Top 0.305: v24.25,33.05 24.84,32.46 40.66,32.46 45.61,37.4 J1.3
  Bottom 0.305: U1.33 25.75,34.61 24.25,33.12 v24.25,33.05
6TX  (via drill 0.38)
  Top 0.305: J1.2 46.08,39.4 40.13,33.45 v26.05,33.45
  Bottom 0.305: U1.32 26.25,33.65 v26.05,33.45
APG
  Bottom 0.305: R12.1 44.55,54.74 45.36,55.55 45.36,56.64 47.39,58.67 APG.1
  Bottom 1.016: Q3.3 43.19,61.8 45.18,61.8 APG.1
APG_F
  Bottom 0.305: U1.15 34.18,53.57 36.22,55.6 36.22,60.68 36.72,61.18 R14.1
APG_S
  Bottom 0.305: R12.2 40.11,54.76 R13.1 38.34,54.02 37.39,53.07 U1.16
AUX  (via drill 0.35)
  Top 0.305: U5.AUX 14.04,19.33 16.53,21.82 v25.3,21.82
  Bottom 0.305: v25.3,21.82 25.3,27.15 28.75,30.61 28.75,48.23 28.75,48.24 U1.27
BT0
  Bottom 0.305: U1.44 22.19,52.57 R2.1
BZZR
  Bottom 0.305: U1.21 31.67,50.57 R11.1
D
  pour Top: 0.1,86.54 arc-90 3.6,90.04 arc-90 7.11,86.54 arc-90 3.58,83.06 arc-90
  pour Top: 46.1,86.49 arc-90 49.63,89.97 arc-90 53.11,86.44 arc-90 49.6,82.98 arc-90
  pour Top: 0.15,5.11 arc-90 3.65,8.61 arc-90 7.16,5.08 arc-90 3.65,1.6 arc-90
  pour Top: 17.62,5.18 arc-90 21.16,8.69 arc-90 24.64,5.16 arc-90 21.13,1.68 arc-90
  pour Top: 27.84,5.13 arc-90 31.37,8.61 arc-90 34.85,5.13 arc-90 31.32,1.6 arc-90
  pour Bottom: 53.11,86.49 arc90 49.58,89.97 arc90 46.1,86.49 arc90 49.68,82.98 arc90
  pour Bottom: 7.11,86.54 arc90 3.6,90.04 arc90 0.1,86.54 arc90 3.58,83.06 3.63,83.06 arc90
  pour Bottom: 7.16,5.08 arc90 3.63,8.61 arc90 0.15,5.11 arc90 3.73,1.6 arc90
  pour Bottom: 24.64,5.23 arc90 21.16,8.69 arc90 17.62,5.16 arc90 21.16,1.68 arc90
  pour Bottom: 34.85,5.13 arc90 31.37,8.61 31.34,8.61 arc90 27.84,5.08 arc90 31.32,1.6 arc90
FN  (via drill 0.35)
  Top 0.305: v24.75,56.9 21.69,56.9 19.89,58.7 19.89,84.33 18.19,86.02 12.52,86.02 R21.2
  Bottom 0.305: v24.75,56.9 v24.75,56.89 U1.2
GND  (via drill 0.41, 0.51)
  Bottom 0.229: 28.74,49.57 27,51.31 | 24.75,49.06 27,51.31 | U1.49 24.75,54.07 U1.47 21.69,54.07 R2.2 | U1.8 27.75,52.06 27,51.31
  Bottom 0.305: U1.23 28.74,49.57 | U1.35 24.75,49.06
  other vias: 23.19,44.45 31.39,45.36 17.35,52.65 17.42,48.67 17.93,56.13 14.07,53.04 25.6,51.51 26.62,53.54 28.65,51.26 43.79,15.82 44.8,15.82 45.82,15.82 46.83,15.57 47.6,14.81 47.6,13.79 47.6,12.78 47.6,11.76 47.6,10.74 47.6,9.73 47.6,8.71 49.65,8.69 49.65,9.7 49.65,10.72 49.65,11.73 49.65,12.75 49.65,13.77 49.65,14.78 49.4,15.8 48.74,16.64 47.98,17.4 47.22,18.16 17.29,50.77
  pour Bottom (rank 2): -0.43,91.41 -0.43,-0.51 53.92,-0.51 53.92,91.41
  pour Top (rank 2): -0.69,91.9 -0.69,-1.02 54.18,-1.02 54.18,91.9
HT
  pour Bottom: 11.25,42.67 11.25,36.07 12.77,34.54 15.31,34.54 18.36,37.59 18.36,41.15 15.31,44.2 12.77,44.2
HT2
  pour Bottom: 2.61,66.04 4.39,67.82 7.95,67.82 10.23,65.53 10.23,61.72 7.95,59.44 4.39,59.44 2.61,61.21
INT  (via drill 0.35)
  Top 0.305: v13.94,54.56 16.89,51.61 20.86,51.61 v21.61,50.86
  Bottom 0.305: U3.7 14.35,55.42 13.94,55.02 v13.94,54.56 | U1.41 21.82,51.07 v21.61,50.86
INT1  (via drill 0.35)
  Top 0.305: v21.87,48.36 20.32,46.81 12.11,46.81 v12.01,46.91
  Bottom 0.305: U2.8 12.51,46.41 v12.01,46.91 | v21.87,48.36 22.17,48.66 22.17,49.33 22.91,50.07 U1.39
INT2  (via drill 0.35)
  Top 0.152: v21.35,49.12 21.35,49.1
  Top 0.305: 21.35,49.1 19.92,47.68 12.44,47.68 v12.09,48.03
  Bottom 0.305: U2.9 12.91,47.21 v12.09,48.03 | v21.35,49.12 21.35,49.57 22.34,50.57 U1.40
M0  (via drill 0.38)
  Top 0.305: v24.2,15.24 U5.M0
  Bottom 0.305: U1.28 28.25,31.07 24.2,27.03 v24.2,15.24
M1  (via drill 0.38)
  Top 0.305: v21.66,15.24 U5.M1
  Bottom 0.305: U1.29 27.75,31.76 21.66,25.68 v21.66,15.24
MAIN
  Bottom 0.305: R7.1 45.26,42.65 47.37,44.75 47.37,49.25 MN.2
  Bottom 1.016: Q2.3 43.49,50.14 MN.2
MAIN_F
  Bottom 0.305: U1.17 35.01,52.57 36.18,51.4 R10.1
MAIN_S
  Bottom 0.305: R7.2 41.92,42.67 R8.1 39.03,43 37.3,44.73 37.3,49.1 34.34,52.07 U1.18
N$1
  Bottom 0.381: D2.1 5.3,44.62 C2.+ 9,44.62 C3.1 9.29,42.54 U7.3
N$2
  Bottom 0.381: D3.1 13.38,58.25 C7.+ 13.36,58.92 C8.1 13.11,60.16 U6.3
N$3
  Top 0.305: U4.10 16.68,76.94 R3.1
N$4
  Bottom 0.381: F1.1 6.63,37.39 4.67,39.35 C4.1 5.4,39.85 C6.+ 7.04,40.13 U7.2
N$5
  Bottom 0.381: U6.2 13.09,64.03 C10.+ 15.18,64.43 C9.1 16.91,66.7 F3.1
N$6
  Bottom 0.813: R14.2 38.91,60.18 R15.2 40.37,60.23 Q3.1 40.73,59.72 ESDA1.1
N$7
  Top 0.61: X4.ANTENNA 48.59,15.3 46.47,17.41 U5.ANT
N$8
  Bottom 0.305: R11.2 33.96,51.23 36.6,48.59 36.6,41.6 SG1.+
N$9
  Bottom 1.524: BT.1 SW.2
N$10
  Top 0.305: U4.6 R9.2
N$11
  Top 0.305: R9.1 D1.A
N$12
  Top 0.305: D4.C 46.56,78.7 R16.2
N$13
  Bottom 0.305: R4.2 39.09,50.4
  Bottom 0.813: R4.2 40.1,50.38 Q2.1 40.88,46.97 ESDA.1 | 39.09,50.4 R10.2
N$14
  Bottom 0.305: R18.1 3.1,40.68 D5.C
N$15
  Bottom 0.305: D6.C R17.1
N$16
  Top 0.381: R19.2 15.88,82.87 U4.8
N$17
  Top 0.381: R19.1 D7.A
N$18
  Bottom 0.305: U1.22 31.93,50.07 C18.2
N$19
  Top 0.305: J2.FEED 9.41,74.43 11.15,74.43 R20.1 10.43,73.71 C25.1
N$20
  Top 0.305: U4.7 16.7,84.59 R21.1 10.44,84.59 R1.1
NRST
  Bottom 0.305: U1.7 27.25,56.43 28.71,57.9 30.43,57.9 C23.1
OSC_IN
  Bottom 0.152: U1.5 26.26,55.33
  Bottom 0.305: Y1.1 24.67,62.97 25.69,61.95 25.69,59.26 C19.1 26.26,58.23 26.26,55.33
OSC_OUT
  Bottom 0.305: Y1.3 28.61,60.53 27.74,59.66 27.74,59.05 | C20.1 27.74,59.05 | 27.74,59.05 26.75,58.06 U1.6
RX  (via drill 0.35)
  Top 0.305: v31.57,54.61 32.31,54.61 34.77,57.07 34.77,71.86 U4.2
  Bottom 0.229: 31.53,54.57 v31.57,54.61
  Bottom 0.305: U1.13 31.53,54.57
RX_TEL  (via drill 0.38)
  Top 0.305: v16.71,18.9 16.71,11.81 U5.TX
  Bottom 0.305: U1.31 26.75,33.02 16.71,22.98 v16.71,18.9
SCL  (via drill 0.51)
  Top 0.305: v18.03,54.97 18.29,54.71 18.29,52.71 v18.59,52.41
  Bottom 0.152: U1.42 23.47,51.59
  Bottom 0.305: 23.47,51.59 20.46,51.59 R5.2 18.59,51.91 v18.59,52.41 18.59,52.08 18.2,51.69 15.8,51.69 15.06,50.96 U2.14 | U3.2 17.98,54.92 v18.03,54.97
SDA
  Bottom 0.305: U1.43 20.53,52.07 19.66,52.94 R6.2 19.66,54.8 18.37,53.51 16.13,53.51 16.05,53.59 | U3.4 16.05,53.59 | 16.05,53.59 14.05,51.59 U2.13
SWCLK
  Bottom 0.305: U1.37 23.5,48.64 21.97,47.12 21.97,38.63 15.21,31.88 4.52,31.88 STM.2
SWDIO
  Bottom 0.305: U1.34 25.25,35.69 20.5,30.94 STM.3
TX  (via drill 0.35)
  Top 0.305: U4.1 32.87,71.22 32.87,58.49 v30.5,56.12
  Bottom 0.305: v30.5,56.12 30.17,56.12 29.75,55.7 U1.12
TX_TEL  (via drill 0.38)
  Top 0.305: v19.12,15.24 U5.RX
  Bottom 0.305: U1.30 27.25,32.25 19.12,24.13 v19.12,15.24
V_BCKP
  Top 0.305: R16.1 48.21,76.92 48.38,77.09
  Top 0.381: 48.38,77.09 B2.+ 48.47,79.79 47.83,80.44 40.35,80.44 C5.+ 36.77,81.89 C24.1 36.61,82.04 U4.5
VCC
  Top 1.016: SW.1 13.76,42.7 33.98,42.7 43.96,52.68 MN.1 48.31,52.73 APG.2
  Bottom 0.381: D2.2 5.08,48.18 SW.1 9.62,52.73 D3.2
VDDA
  Bottom 0.229: 33.05,59.03 VDDA1.1
  Bottom 0.305: U1.9 28.25,56.22 29.13,57.1 31.51,57.1 VDDA2.1 31.96,57 32.9,57.94 VDDA1.1 | L1.2 33.05,59.03
XANT
  Top 0.305: 12.15,74.42 12.03,74.42 12.7,73.75 C28.1 | 12.15,74.42 U4.11 | R20.2 12.15,74.42

### Text on the board
tPlace: EPHEMERIS | MERGEN / 09.03.2021